# Altium schematic sheet PWR_CTRL.SchDoc
size A; SheetNumber: 8; SheetTotal: 28
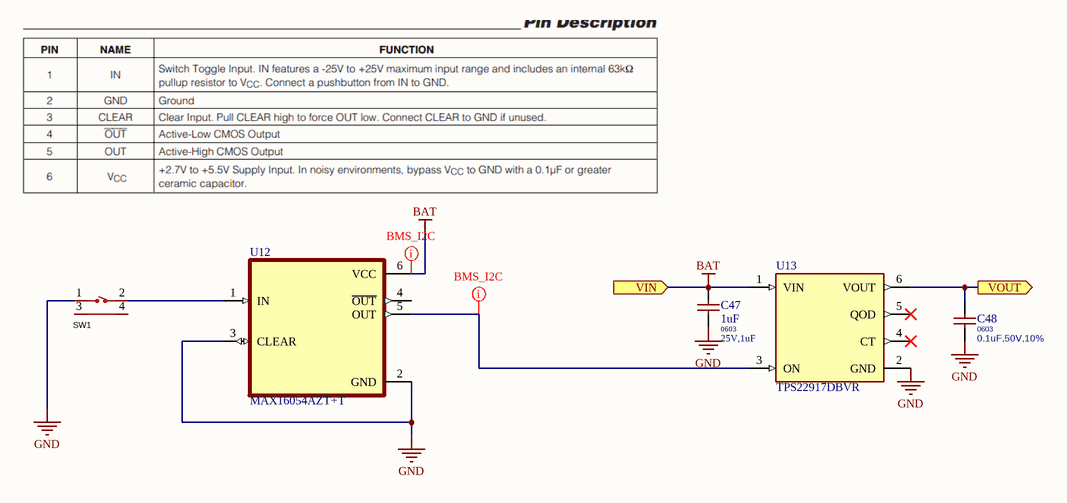
[diagram p0: PWR_CTRL.SchDoc]

## Parts
C47  1uF  value 25V,1uF  Package: 0603  [CAPC1608X90N]
C48  Package: 0603  [C0603]  (hidden comment: 0.1uF,50V,10%)
SW1  (no value)  [SW-TH_4P-L7.5-W8.0-P4.50]
U12  MAX16054AZT+T  [SOT95P275X110-6N]
U13  TPS22917DBVR  [SOT95P280X145-6N]

## Ports
VIN (in), VOUT (out)

## Nets
BAT: C47.2 U12.6(VCC) U13.1(VIN) ; port VIN
GND: C47.1 C48.1 SW1.1 U12.2(GND) U12.3(CLEAR) U13.2(GND)
VOUT: C48.2 U13.6(VOUT) ; port VOUT
NetSW1_2: SW1.2 U12.1(IN)
NetU12_5: U12.5(OUT) U13.3(ON)

Not connected (* = marked no-connect by the designer): SW1 3 4; U12 4(~{OUT}); U13 4(CT)* 5(QOD)*

## Layout directives
net class BMS_I2C: BAT, NetU12_5

## Library data of the parts
C47 = 0603B105K250NT: 25V 1uF X7R ±10% 0603 Multilayer Ceramic Capacitors MLCC - SMD/SMT ROHS; Manufacturer: FH (Guangdong Fenghua Advanced Tech); LCSC: C59302; Datasheet: https://datasheet.lcsc.com/lcsc/2304140030_FH--Guangdong-Fenghua-Advanced-Tech-0603B105K250NT_C59302.pdf; MPN: 0603B105K250NT
C48 = GCM188R71H104KA57J: CAP CER 0.1UF 50V X7R 0603; Manufacturer: Murata Electronics; Type: SM; Min Operating Temp: -55°C; Max Operating Temp: 125°C; MPN: GCM188R71H104KA57J; Datasheet: https://datasheet.lcsc.com/lcsc/2404081050_Murata-Electronics-GCM188R71H104KA57J_C3011652.pdf; LCSC: C3011652; Value: 0.1uF,50V,10%
SW1 = TC-6615-8-260G: None With bracket 50mA 6mm 100000 Times 260gf 12V 6mm 8mm Round Button Bend-in SPST Plugin Tactile Switches ROHS; Manufacturer: HCTL; LCSC: C2845277; MPN: TC-6615-8-260G; Package: L6*H8; Datasheet: https://atta.szlcsc.com/upload/public/pdf/source/20230523/3B07ECEFF69432C539FEAF1B55455C52.pdf; Switch Length: 6mm; Switch Height: 8mm; Operating Temperature: -25℃~+85℃
U12 = MAX16054AZT+T: On/Off Controller with Debounce and Â±15kV ESD Protection; MF: Analog Devices; Check_prices: https://www.snapeda.com/parts/MAX16054AZT+T/Analog+Devices/view-part/?ref=eda; Package: SOT-23-6 Maxim; Availability: In Stock; Value: *; Purchase-URL: https://pricing.snapeda.com/search/part/MAX16054AZT+T/?ref=eda; MP: MAX16054AZT+T; SnapEDA_Link: https://www.snapeda.com/parts/MAX16054AZT+T/Analog+Devices/view-part/?ref=snap; Price: None
U13 = TPS22917DBVR: 5.5-V, 2-A, 80-mÎ© , 10-nA leakage load switch adj. rise time and adj output discharge; MF: Texas Instruments; SnapEDA_Link: https://www.snapeda.com/parts/TPS22917DBVR/Texas+Instruments/view-part/?ref=snap; Package: SOT-23-6 Texas Instruments; Value: *; MP: TPS22917DBVR; Check_prices: https://www.snapeda.com/parts/TPS22917DBVR/Texas+Instruments/view-part/?ref=eda